# EAGLE design Master (EAGLE 9.1.3)
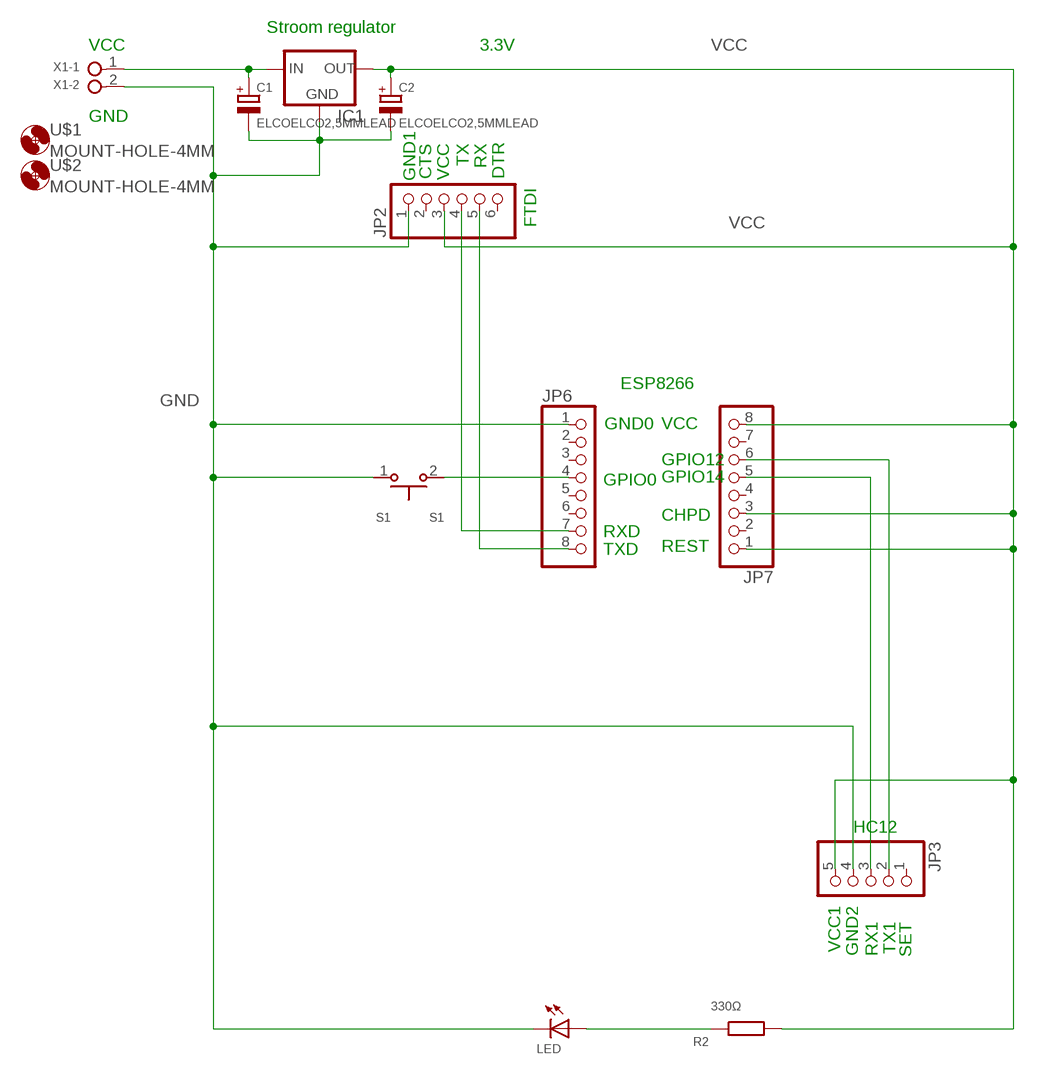
[diagram p0: schematic, sheet 1]

## Parts
C1  ELCOELCO2,5MMLEAD  [ELCO-2.5MMLEAD]
C2  ELCOELCO2,5MMLEAD  [ELCO-2.5MMLEAD]
IC1  LM1117-TO220  [TO220V]
JP2  PINHD-1X6  [1X06]
JP3  PINHD-1X5  [1X05]
JP6  PINHD-1X8  [1X08]
JP7  PINHD-1X8  [1X08]
LED  LED-SMD1206  [CHIPLED_1206]
R2  330Ω  RESISTOR-SMD-1206  [R1206W]
S1  MICROSWITCH-B3U-1000P  [MICROSWITCH-B3U-1000P]
U$1  MOUNT-HOLE-4MM  [4,0]
U$2  MOUNT-HOLE-4MM  [4,0]
X1  TERMINAL-5MM-2POLE  [W237-132]

## Nets
GND [VCC]: C1.- C2.- IC1.1(GND) JP2.1 JP3.4 JP6.1 LED.C S1.1 X1.2
N$1: LED.A R2.1
N$2: JP3.2 JP7.6
N$3: JP3.3 JP7.5
N$4: JP6.4 S1.2
N$5: JP2.5 JP6.8
N$6: JP2.4 JP6.7
VCC [VCC]: C2.+ IC1.2(OUT) JP2.3 JP3.5 JP7.1 JP7.3 JP7.8 R2.2
VIN [VCC]: C1.+ IC1.3(IN) X1.1
Unconnected: JP2.2 JP2.6 JP3.1 JP6.2 JP6.3 JP6.5 JP6.6 JP7.2 JP7.4 JP7.7

## Notes on the sheet
- Stroom regulator
- VCC | 3.3V
- GND
- CTS | VCC | TX | RX | DTR
- GND1
- FTDI
- ESP8266
- GND0 | VCC
- GPIO12
- GPIO0 | GPIO14
- CHPD
- RXD
- TXD | REST
- HC12
- RX1 | SET
- VCC1 | GND2 | TX1

## Library data of the parts
C1 C2 = ESP8266-12F controller PCB:ELCO: electrolytic capacitor 2.5mm or 3.5mm lead or SMD
IC1 = ESP8266-12F controller PCB:LM1117-TO220: LM1117 TO220 VOLTAGE REGULATOR
JP2 = pinhead:PINHD-1X6: PIN HEADER
JP3 = pinhead:PINHD-1X5: PIN HEADER
JP6 JP7 = pinhead:PINHD-1X8: PIN HEADER
LED = test:LED-SMD: LED SMD 1206
R2 = ESP8266-12F controller PCB:RESISTOR-SMD-1206: Resistor 1206 SMD
S1 = ESP8266-12F controller PCB:MICROSWITCH-B3U-1000P: microswitch
U$1 U$2 = ESP8266-12F controller PCB:MOUNT-HOLE-4MM
X1 = ESP8266-12F controller PCB:TERMINAL-5MM-2POLE: WAGO SCREW CLAMP; OC_FARNELL: unknown; OC_NEWARK: unknown

## Net classes
1 VCC: width 1.016 mm

## Board
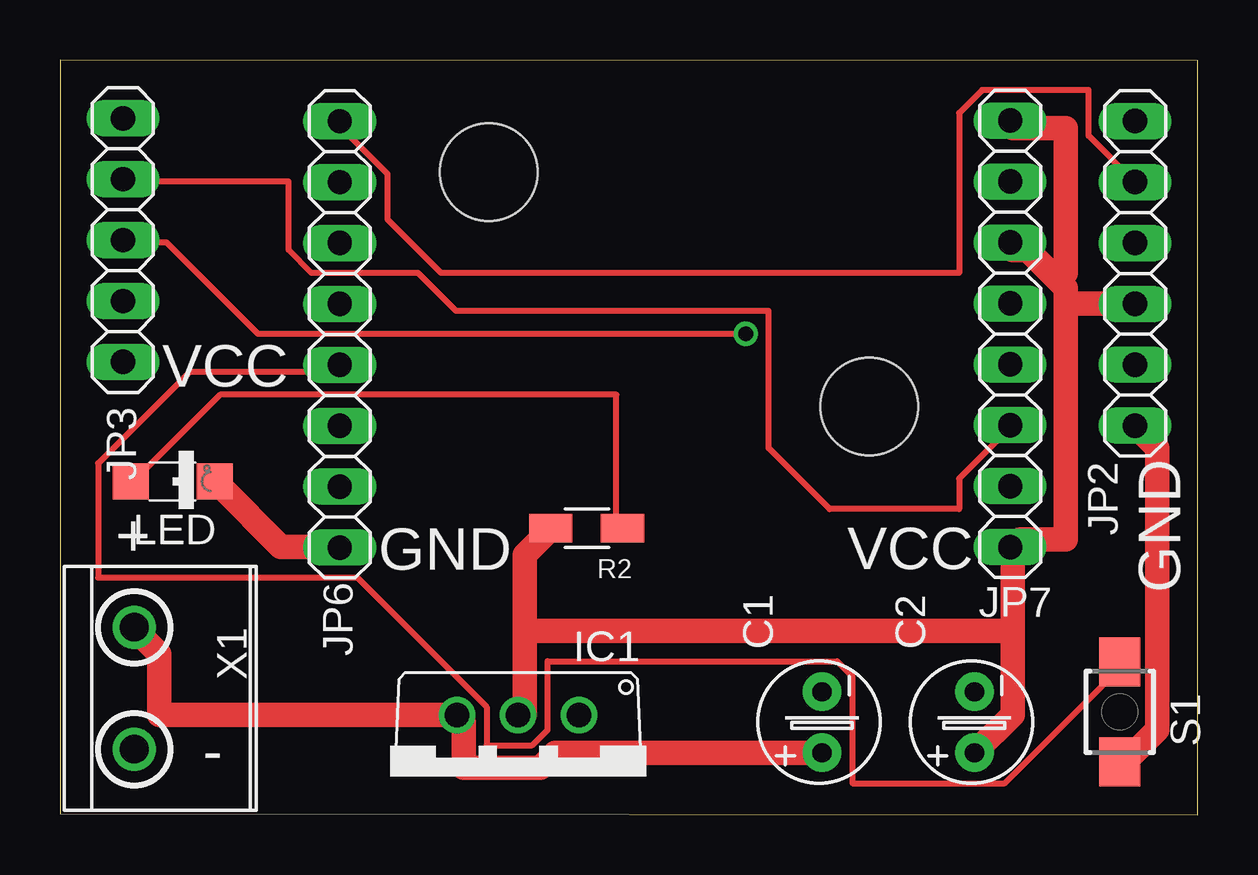
[diagram p1: board, top side]
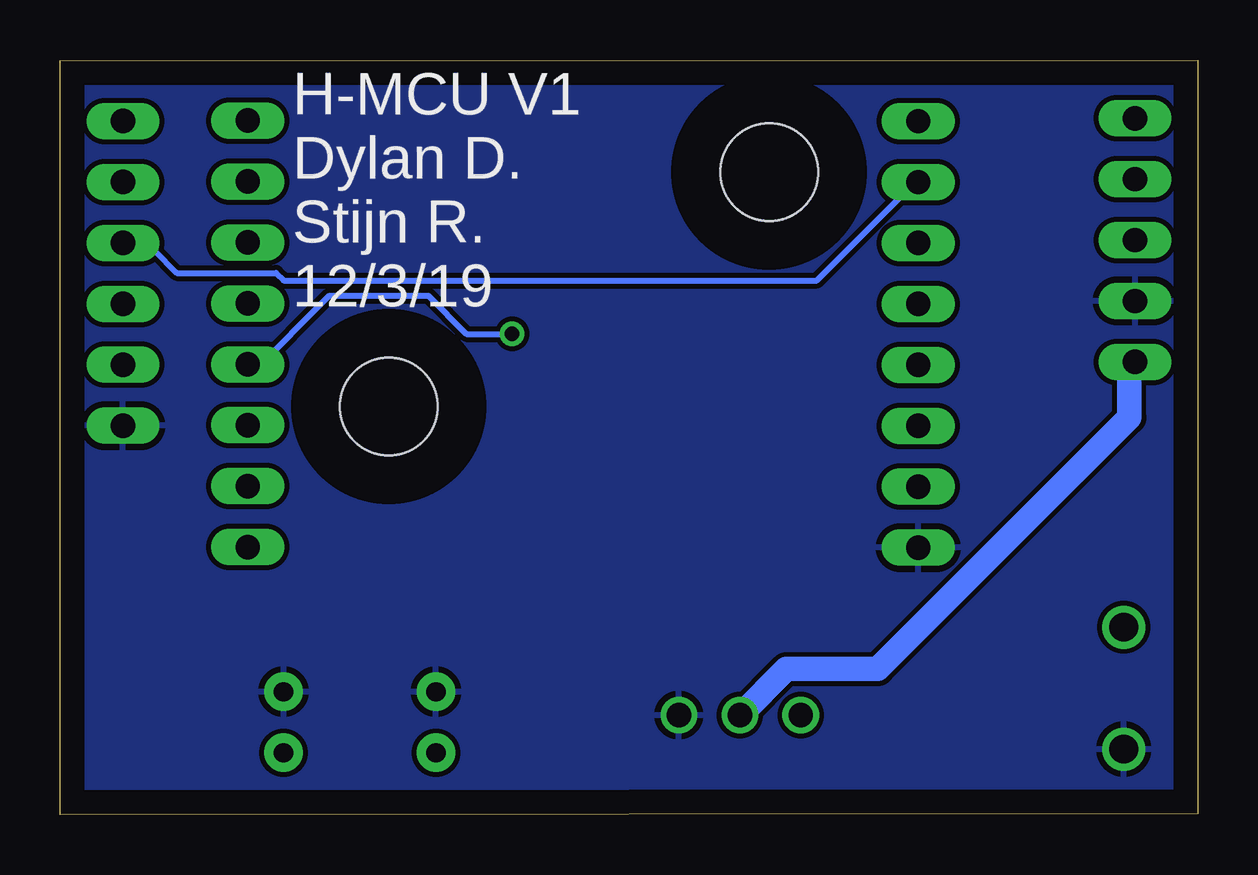
[diagram p2: board, bottom side, seen from below]

Size 47.42 x 31.46 mm. Coordinates in mm from the lower left corner, seen from the top.
Outline: 0,0.04 47.42,0 47.42,31.42 0,31.46 0,0.04
Copper layers (1*16): Top 0.035mm / dielectric 1.5mm / Bottom 0.035mm
Design rules "default": minimum track width 10mil, minimum drill 24mil, track to track 8mil, track to pad 8mil, pad to pad 8mil, via to via 8mil, smd to smd 8mil, copper to edge 40mil, drill to drill 8mil, minimum pad ring 10mil, minimum via ring 8mil, stop-mask expansion 4mil, vias tented up to drill 0mil, thermal gap 10mil

### Footprints (pad centres in the part's own frame; a part is rotated, then mirrored left to right if it is on the bottom)
ELCO-2.5MMLEAD = drill 0.8 pad 1.6: + -1.27,0; - 1.27,0
TO220V = drill 1.016: 1 -2.54,-2.54; 2 0,-2.54; 3 2.54,-2.54
1X06 = drill 1.016 long: 1 -6.35,0; 2 -3.81,0; 3 -1.27,0; 4 1.27,0; 5 3.81,0; 6 6.35,0
1X05 = drill 1.016 long: 1 -5.08,0; 2 -2.54,0; 3 0,0; 4 2.54,0; 5 5.08,0
1X08 = drill 1.016 long: 1 -8.89,0; 2 -6.35,0; 3 -3.81,0; 4 -1.27,0; 5 1.27,0; 6 3.81,0; 7 6.35,0; 8 8.89,0
CHIPLED_1206 = smd 1.5 x 1.5: A 0,-1.75; C 0,1.75
R1206W = smd 1.8 x 1.2: 1 -1.499,0; 2 1.499,0
MICROSWITCH-B3U-1000P = smd 2.032 x 1.7: 1 -2.081,0; 2 2.081,0
4,0 = hole 4.064: 0,0
W237-132 = drill 1.194: 1 -2.54,-0.635; 2 2.54,-0.635

### Placement (x,y rotation side)
C1  31.75,3.85 90 top
C2  38.1,3.85 90 top
IC1  19.09,1.61 180 top
JP2  44.8,22.56 90 top
JP3  2.62,23.95 270 top
JP6  11.66,20.02 90 top
JP7  39.59,20.04 270 top
LED  4.69,13.89 270 top
R2  21.94,11.94 180 top
S1  44.16,4.28 90 top
U$1  17.87,26.79 0 top
U$2  33.72,17.02 0 top
X1  3.73,5.27 270 top

### Tracks (layer width: path | path; a pad name or v marks a point on that pad's centre or on a via)
GND
  Top 1.016: LED.C 6.67,13.69 9.21,11.15 11.43,11.15 JP6.1 | S1.1 44.45,2.26 45.72,3.53 45.72,15.28 45.09,15.92 JP2.1
  pour Bottom: 0,0.04 0,31.46 47.41,31.46 47.42,31.45 47.42,0.04
N$1
  Top 0.254: LED.A 3.17,14.01 6.67,17.5 23.18,17.5 23.18,12.11 R2.1
N$2
  Top 0.254: JP3.2 2.86,26.39 9.53,26.39 9.53,23.54 10.48,22.58 14.92,22.58 16.51,21 29.53,21 29.53,15.28 32.07,12.74 37.47,12.74 37.47,14.01 39.37,15.92 JP7.6
N$3  (via drill 0.61)
  Top 0.254: v28.57,20.04 8.26,20.04 4.45,23.85 2.86,23.85 JP3.3
  Bottom 0.254: v28.57,20.04 30.48,20.04 32.07,21.63 36.2,21.63 39.37,18.46 JP7.5
N$4
  Top 0.254: S1.2 44.13,6.07 39.37,1.31 33.02,1.31 33.02,5.76 32.38,6.39 20.32,6.39 20.32,3.53 19.68,2.9 17.78,2.9 17.78,4.49 12.38,9.88 1.59,9.88 1.59,14.65 5.4,18.46 11.43,18.46 JP6.4
N$5
  Top 0.254: JP6.8 11.75,28.62 13.65,26.71 13.65,24.81 15.88,22.58 37.47,22.58 37.47,29.25 38.42,30.2 42.86,30.2 42.86,28.3 44.77,26.39 JP2.5
N$6
  Bottom 0.254: JP6.7 11.75,26.08 12.06,26.08 15.88,22.27 38.1,22.27 38.42,22.58 42.55,22.58 43.5,23.54 44.77,23.54 JP2.4
VCC
  Top 1.016: 19.37,7.66 19.37,4.17 IC1.2 | 19.37,7.66 19.37,10.84 20.32,11.79 R2.2 | 39.69,7.66 39.69,4.17 C2.+ | 39.69,7.66 39.69,10.84 JP7.8 40.01,11.47 41.91,11.47 41.91,21 41.91,21.31 | 41.91,21.31 44.77,21.31 JP2.3 | 41.91,21.31 41.91,21.95 41.59,22.27 | 41.59,22.27 40.32,23.54 39.69,23.54 JP7.3 | JP7.1 39.69,28.62 41.91,28.62 41.91,22.58 41.59,22.27 | 19.37,7.66 19.68,7.66 39.37,7.66 39.69,7.66
  Bottom 1.016: JP3.5 2.86,18.77 2.86,16.55 13.34,6.07 17.14,6.07 19.05,4.17 IC1.2
VIN
  Top 1.016: X1.1 3.17,7.66 4.13,6.71 4.13,4.17 16.51,4.17 IC1.3 16.83,3.85 16.83,1.95 20,1.95 20.64,2.58 C1.+

### Text on the board
bPlace: H-MCU V1 / Dylan D. / Stijn R. / 12/3/19
tNames: VCC | GND | + | VCC | GND | -